# EAGLE design stop_circuit (EAGLE 9.6.2)
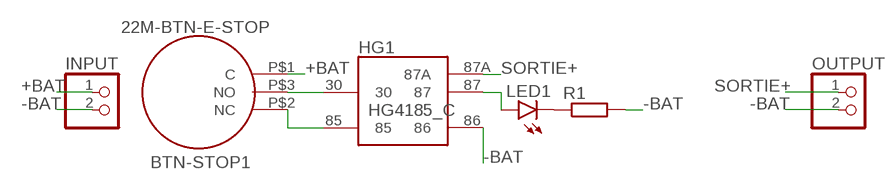
[diagram p0: schematic, sheet 1]

## Parts
BTN-STOP1  22M-BTN-E-STOP  [22MM-BTN-E-STOP]
HG1  HG4185_C  [HG4185_C_1Z]
INPUT  PINHD-1X2  [1X02]
LED1  LEDB156  [Q62902-B156]
OUTPUT  PINHD-1X2  [1X02]
R1  R-EU_0204/7  [0204/7]

## Nets
+BAT: BTN-STOP1.P$1(C) INPUT.1
-BAT: HG1.86 INPUT.2 OUTPUT.2 R1.2
N$1: BTN-STOP1.P$3(NO) HG1.30
N$2: BTN-STOP1.P$2(NC) HG1.85
N$3: LED1.K(C) R1.1
N$4: HG1.87 LED1.A
SORTIE+: HG1.87A OUTPUT.1

## Library data of the parts
BTN-STOP1 = 22MM-E-STOP:22M-BTN-E-STOP
HG1 = HG4185_C:HG4185_C
INPUT OUTPUT = pinhead:PINHD-1X2: PIN HEADER
LED1 = led:LED: LED OSRAM: - CHIPLED LG R971, LG N971, LY N971, LG Q971, LY Q971, LO R971, LY R971 LH N974, LH R974 LS Q976, LO Q976, LY Q976 LO Q996 - Hyper CHIPLED LW Q18S LB Q993, LB Q99A, LB R99A - SideLED LS A670, LO A670, LY A670, LG A670, LP A670 LB A673, LV A673, LT A673, LW A673 LH A674 LY A675 LS A676, LA A676, LO A676, LY A676, LW A676 LS A679, LY A679, LG A679 - Hyper Micro SIDELED® LS Y876, LA Y876, LO Y876, LY Y876 LT Y87S - SmartLED LW L88C, LW L88S LB L89C, LB L89S, LG L890 LS L89K, LO L89K, LY L89K LS L896, LA L896, LO L896, LY L896 - TOPLED LS T670, LO T670, LY T670, LG T670, LP T670 LSG T670, LSP T670, LSY T670, LOP T670, LYG T670 LG T671, LOG T671, LSG T671 LB T673, LV T673, LT T673, LW T673 LH T674 LS T676, LA T676, LO T676, LY T676, LB T676, LH T676, LSB T676, LW T676 LB T67C, LV T67C, LT T67C, LS T67K, LO T67K, LY T67K, LW E67C LS E67B, LA E67B, LO E67B, LY E67B, LB E67C, LV E67C, LT E67C LW T67C LS T679, LY T679, LG T679 LS T770, LO T770, LY T770, LG T770, LP T770 LB T773, LV T773, LT T773, LW T773 LH T774 LS E675, LA E675, LY E675, LS T675 LS T776, LA T776, LO T776, LY T776, LB T776 LHGB T686 LT T68C, LB T68C - Hyper Mini TOPLED® LB M676 - Mini TOPLED Santana® LG M470 LS M47K, LO M47K, LY M47K Source: http://www.osram.convergy.de LUXEON: - LUMILED® LXK2-PW12-R00, LXK2-PW12-S00, LXK2-PW14-U00, LXK2-PW14-V00 LXK2-PM12-R00, LXK2-PM12-S00, LXK2-PM14-U00 LXK2-PE12-Q00, LXK2-PE12-R00, LXK2-PE12-S00, LXK2-PE14-T00, LXK2-PE14-U00 LXK2-PB12-K00, LXK2-PB12-L00, LXK2-PB12-M00, LXK2-PB14-N00, LXK2-PB14-P00, LXK2-PB14-Q00 LXK2-PR12-L00, LXK2-PR12-M00, LXK2-PR14-Q00, LXK2-PR14-R00 LXK2-PD12-Q00, LXK2-PD12-R00, LXK2-PD12-S00 LXK2-PH12-R00, LXK2-PH12-S00 LXK2-PL12-P00, LXK2-PL12-Q00, LXK2-PL12-R00 Source: www.luxeon.com KINGBRIGHT: KA-3528ASYC Source: www.kingbright.com
R1 = rcl:R-EU_: RESISTOR, European symbol; SPICEPREFIX: R

## Board
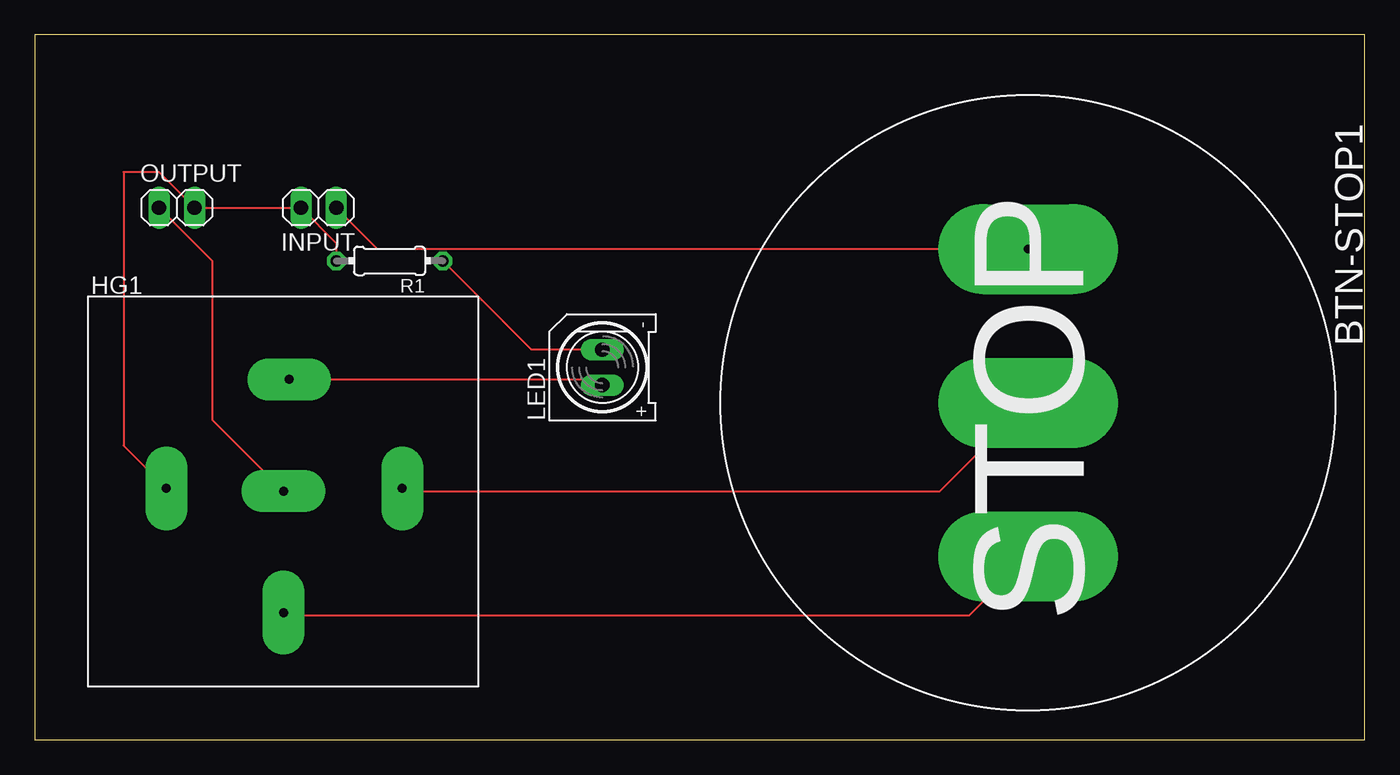
[diagram p1: board, top side]

Size 95.23 x 50.47 mm. Coordinates in mm from the lower left corner, seen from the top.
Outline: 0,0 95.23,0 95.23,50.47 0,50.47 0,0
Copper layers (1*16): Top 0.035mm / dielectric 1.5mm / Bottom 0.035mm
Design rules "default": minimum track width 6mil, minimum drill 0.35mm, track to track 6mil, track to pad 6mil, pad to pad 6mil, via to via 6mil, smd to smd 6mil, copper to edge 40mil, drill to drill 6mil, minimum pad ring 10mil, minimum via ring 8mil, stop-mask expansion 4mil, vias tented up to drill 0mil, thermal gap 10mil

### Footprints (pad centres in the part's own frame; a part is rotated, then mirrored left to right if it is on the bottom)
22MM-BTN-E-STOP = drill 0.6 pad 6.452 long: P$1 -11,0; P$2 0,0; P$3 11,0
HG4185_C_1Z = drill 0.65 pad 3 long: 30 14,5.3; 85 22.5,14.2; 86 5.6,14.2; 87 14.4,22; 87A 14,14
1X02 = drill 1.016 long: 1 -1.27,0; 2 1.27,0
Q62902-B156 = drill 1.016 long: A -1.27,0; K 1.27,0
0204/7 = drill 0.813 octagon: 1 -3.81,0; 2 3.81,0

### Placement (x,y rotation side)
BTN-STOP1  71.12,24.13 270 top
HG1  3.81,3.81 0 top
INPUT  20.32,38.1 180 top
LED1  40.64,26.67 90 top
OUTPUT  10.16,38.1 0 top
R1  25.4,34.29 180 top

### Tracks (layer width: path | path; a pad name or v marks a point on that pad's centre or on a via)
+BAT
  Top 0.152: BTN-STOP1.P$1 24.56,35.13 INPUT.1
-BAT
  Top 0.152: R1.2 21.59,35.56 INPUT.2 OUTPUT.2 8.89,40.64 6.35,40.64 6.35,21.07 HG1.86
N$1
  Top 0.152: BTN-STOP1.P$3 66.88,8.89 18.03,8.89 HG1.30
N$2
  Top 0.152: BTN-STOP1.P$2 64.77,17.78 26.54,17.78 HG1.85
N$3
  Top 0.152: LED1.K 35.56,27.94 R1.1
N$4
  Top 0.152: HG1.87 40.23,25.81 LED1.A
SORTIE+
  Top 0.152: OUTPUT.1 12.7,34.29 12.7,22.92 HG1.87A